# Altium project FlightLogger.PrjPcb
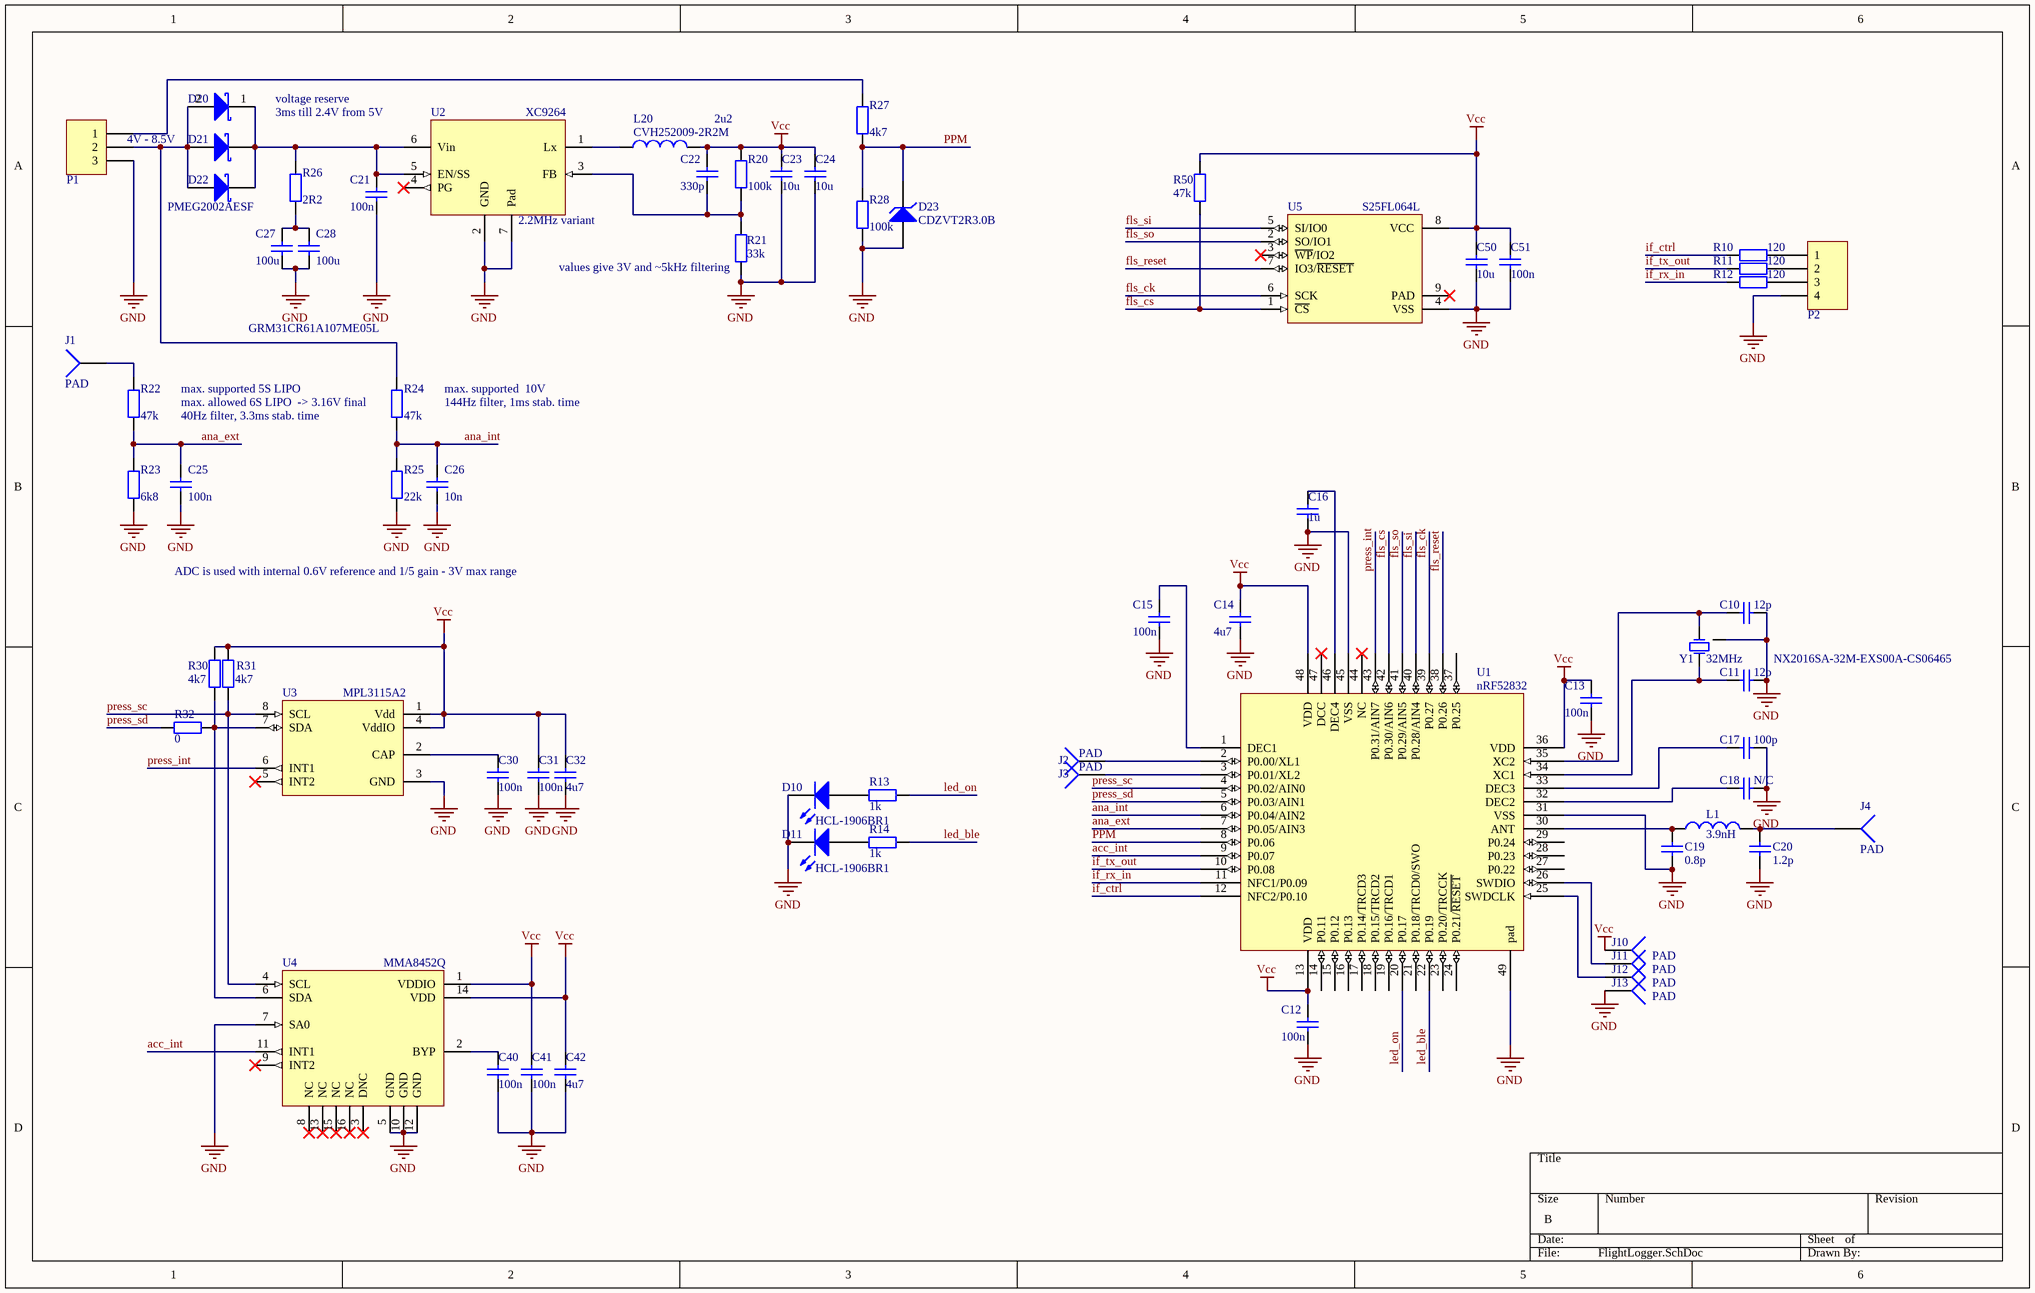
[diagram p0: FlightLogger.SchDoc]
1 sheet, 69 parts. Net scope: global (net labels, ports and power ports of the same name join across sheets).
Board file: FlightLogger.PcbDoc

## Sheet FlightLogger.SchDoc
size B; PageSetup: Record=PageOptions|CenterHorizontal=True|CenterVertical=True|PrintScale=0.70|XCorrection=1.00|YCorrection=1.00|PrintKind=1|BorderSize=5000000|LeftOffset=0|BottomOffset=0|Orientation=2|PaperLength=1000|PaperWidth=1000|Scale=100|PaperSource=7|PrintQuality=-4|MediaType=1|DitherType=10|PrintScaleMode=1|PaperKind=Letter 8.5"x11" 22x28cm|PaperIndex=1

### Parts
C10  12p  [0402_cap]
C11  12p  [0402_cap]
C12  100n  [0402_cap]
C13  100n  [0402_cap]
C14  4u7  [0402_cap]
C15  100n  [0402_cap]
C16  1u  [0402_cap]
C17  100p  [0402_cap]
C18  N/C  [0402_cap]
C19  0.8p  [0402_cap]
C20  1.2p  [0402_cap]
C21  100n  [0402_cap]
C22  330p  [0402_cap]
C23  10u  [0402_cap]
C24  10u  [0402_cap]
C25  100n  [0402_cap]
C26  10n  [0402_cap]
C27  PartNo: GRM31CR61A107ME05L  [1206_cap]  (hidden comment: 100u)
C28  100u  [1206_cap]
C30  100n  [0402_cap]
C31  100n  [0402_cap]
C32  4u7  [0402_cap]
C40  100n  [0402_cap]
C41  100n  [0402_cap]
C42  4u7  [0402_cap]
C50  10u  [0402_cap]
C51  100n  [0402_cap]
D10  HCL-1906BR1  [0603_led_green]
D11  HCL-1906BR1  [0603_led_green]
D20  PMEG2002AESF  [SOD962_2]  (value not drawn)
D21  PMEG2002AESF  [SOD962_2]  (value not drawn)
D22  PMEG2002AESF  [SOD962_2]
D23  CDZVT2R3.0B  [VMN2M]
J1  PAD  [PAD_0.6x1mm]
J2  PAD  [PAD_0.6x1mm]
J3  PAD  [PAD_0.6x1mm]
J4  PAD  [PAD_0.6x1mm]
J10  PAD  [PAD_0.6x1mm]
J11  PAD  [PAD_0.6x1mm]
J12  PAD  [PAD_0.6x1mm]
J13  PAD  [PAD_0.6x1mm]
L1  3.9nH  [0402_res]
L20  CVH252009-2R2M  value 2u2  [1008_Inductor]
P1  Conn3  [HDR1X3]  (value not drawn)
P2  Conn4  [conn_4pin_1row_1mm]  (value not drawn)
R10  120  [0402_res]
R11  120  [0402_res]
R12  120  [0402_res]
R13  1k  [0402_res]
R14  1k  [0402_res]
R20  100k  [0402_res]
R21  33k  [0402_res]
R22  47k  [0402_res]
R23  6k8  [0402_res]
R24  47k  [0402_res]
R25  22k  [0402_res]
R26  2R2  [0603_res]
R27  4k7  [0402_res]
R28  100k  [0402_res]
R30  4k7  [0402_res]
R31  4k7  [0402_res]
R32  0  [0402_res]
R50  47k  [0402_res]
U1  nRF52832  [QFN48]
U2  XC9264  [USP-6C]
U3  MPL3115A2  [MPL3115A2]
U4  MMA8452Q  [QFN16SP]
U5  S25FL064L  [USON8]
Y1  32MHz  Part.No: NX2016SA-32M-EXS00A-CS06465  [Cristal_2_1.6_4pin]

### Nets
GND: C10.1 C11.1 C12.2 C13.2 C14.2 C15.2 C16.2 C17.1 C18.1 C19.1 C20.1 C21.2 C23.2 C24.2 C25.2 C26.2 C27.1 C28.1 C30.1 C31.1 C32.1 C40.1 C41.1 C42.1 C50.1 C51.1 D10.2(K) D11.2(K) D23.1(A) J13.1 P1.3 P2.4 R21.1 R23.2 R25.2 R28.2 U1.31(VSS) U1.45(VSS) U1.49(pad) U2.2(GND) U2.7(Pad) U3.3(GND) U4.5(GND) U4.7(SA0) U4.10(GND) U4.12(GND) U5.4(VSS) Y1.2(GND)
Vcc: C12.1 C13.1 C14.1 C22.1 C23.1 C24.1 C31.2 C32.2 C41.2 C42.2 C50.2 C51.2 J10.1 L20.2 R20.1 R30.1 R31.1 R50.1 U1.13(VDD) U1.36(VDD) U1.48(VDD) U3.1(Vdd) U3.4(VddIO) U4.1(VDDIO) U4.14(VDD) U5.8(VCC)
acc_int: U1.9(P0.07) U4.11(INT1)
ana_ext: C25.1 R22.2 R23.1 U1.7(P0.05/AIN3)
ana_int: C26.1 R24.2 R25.1 U1.6(P0.04/AIN2)
fls_ck: U1.39(P0.27) U5.6(SCK)
fls_cs: R50.2 U1.42(P0.30/AIN6) U5.1(~{CS})
fls_reset: U1.38(P0.26) U5.7(IO3/~{RESET})
fls_si: U1.40(P0.28/AIN4) U5.5(SI/IO0)
fls_so: U1.41(P0.29/AIN5) U5.2(SO/IO1)
if_ctrl: R10.2 U1.12(NFC2/P0.10)
if_rx_in: R12.2 U1.11(NFC1/P0.09)
if_tx_out: R11.2 U1.10(P0.08)
led_ble: R14.1 U1.22(P0.19)
led_on: R13.1 U1.20(P0.17)
PPM: D23.2(K) R27.2 R28.1 U1.8(P0.06)
press_int: U1.43(P0.31/AIN7) U3.6(INT1)
press_sc: R31.2 U1.4(P0.02/AIN0) U3.8(SCL) U4.4(SCL)
press_sd: R32.2 U1.5(P0.03/AIN1)
NetC10_2: C10.2 U1.35(XC2) Y1.1(OSC1)
NetC11_2: C11.2 U1.34(XC1) Y1.3(OSC2)
NetC15_1: C15.1 U1.1(DEC1)
NetC16_1: C16.1 U1.46(DEC4)
NetC17_2: C17.2 U1.33(DEC3)
NetC18_2: C18.2 U1.32(DEC2)
NetC19_2: C19.2 L1.1 U1.30(ANT)
NetC20_2: C20.2 J4.1 L1.2
NetC21_1: C21.1 D20.1(K) D21.1(K) D22.1(K) R26.1 U2.5(EN/SS) U2.6(Vin)
NetC22_2: C22.2 R20.2 R21.2 U2.3(FB)
NetC27_2: C27.2 C28.2 R26.2
NetC30_2: C30.2 U3.2(CAP)
NetC40_2: C40.2 U4.2(BYP)
NetD10_1: D10.1(A) R13.2
NetD11_1: D11.1(A) R14.2
NetD20_2: D20.2(A) D21.2(A) D22.2(A) P1.2 R24.1
NetJ1_1: J1.1 R22.1
NetJ2_1: J2.1 U1.2(P0.00/XL1)
NetJ3_1: J3.1 U1.3(P0.01/XL2)
NetJ11_1: J11.1 U1.26(SWDIO)
NetJ12_1: J12.1 U1.25(SWDCLK)
NetL20_1: L20.1 U2.1(Lx)
NetP1_1: P1.1 R27.1
NetP2_1: P2.1 R10.1
NetP2_2: P2.2 R11.1
NetP2_3: P2.3 R12.1
NetR30_2: R30.2 R32.1 U3.7(SDA) U4.6(SDA)

Not connected (* = marked no-connect by the designer): U1 14(P0.11) 15(P0.12) 16(P0.13) 17(P0.14/TRCD3) 18(P0.15/TRCD2) 19(P0.16/TRCD1) 21(P0.18/TRCD0/SWO) 23(P0.20/TRCCK) 24(P0.21/~{RESET}) 27(P0.22) 28(P0.23) 29(P0.24) 37(P0.25) 44(NC)* 47(DCC)*; U2 4(PG)*; U3 5(INT2)*; U4 3(DNC)* 8(NC)* 9(INT2)* 13(NC)* 15(NC)* 16(NC)*; U5 3(~{WP}/IO2)* 9(PAD)*

### Notes on the sheet
- voltage reserve
- 4V - 8.5V
- 3ms till 2.4V from 5V
- (near U2) 2.2MHz variant
- (near R21) values give 3V and ~5kHz filtering
- (near R22) max. supported 5S LIPO
- (near R24) max. allowed 6S LIPO  -> 3.16V final
- 40Hz filter, 3.3ms stab. time
- (near R24) max. supported  10V
- 144Hz filter, 1ms stab. time
- ADC is used with internal 0.6V reference and 1/5 gain - 3V max range

### Library data of the parts
C10-C27 C30-C32 C40-C42 C50 C51 = CAP: Capacitor; Published: 8-Jun-2000; LatestRevisionDate: 17-Jul-2002; LatestRevisionNote: Re-released for DXP Platform.; PackageReference: RAD-0.3; Publisher: Altium Limited; PackageDescription: Radial Cap, Thru-Hole; 2 Leads; 0.3 in Pin Spacing
  C10 C11: Value: 12p
  C12 C13 C15 C21 C25 C30 C31 C40 C41 C51: Value: 100n
  C14 C32 C42: Value: 4u7
  C16: Value: 1u
  C17: Value: 100p
  C18: Value: N/C
  C19: Value: 0.8p
  C20: Value: 1.2p
  C22: Value: 330p
  C23 C24 C50: Value: 10u
  C26: Value: 10n
  C27: Value: 100u
C28 = CAP: Capacitor; PartNo: GRM31CR61A107ME05L; Published: 8-Jun-2000; LatestRevisionDate: 17-Jul-2002; LatestRevisionNote: Re-released for DXP Platform.; PackageReference: RAD-0.3; Publisher: Altium Limited; PackageDescription: Radial Cap, Thru-Hole; 2 Leads; 0.3 in Pin Spacing; Value: 100u
D10 D11 = LED: Typical RED, GREEN, YELLOW, AMBER GaAs LED; Published: 8-Jun-2000; LatestRevisionDate: 17-Jul-2002; LatestRevisionNote: Re-released for DXP Platform.; PackageVersion: Feb-2002; PackageReference: 3.2X1.6X1.1; Publisher: Altium Limited; PackageDescription: SM LED; 2 Flat Leads
D20-D22 = 1PS76SB10: Schottky Barrier Diode; Published: 17-Sep-2003; LatestRevisionDate: 19-Mar-2004; LatestRevisionNote: Silkscreen size reduced.; DatasheetVersion: 14-Oct-1996; PackageVersion: May-1999; PackageReference: SOD323; Publisher: Altium Limited; PackageDescription: SOD-323/SC-76; 2 Leads; Body 1.7 x 1.3 mm, (LxW); ComponentLink1Description: Manufacturer Link; ComponentLink1URL: http://www.semiconductors.philips.com/; ComponentLink2Description: Datasheet; ComponentLink2URL: http://www.semiconductors.philips.com/acrobat/datasheets/1PS76SB10_2.pdf
D23 = D Zener: Zener Diode; Published: 8-Jun-2000; LatestRevisionDate: 17-Jul-2002; LatestRevisionNote: Re-released for DXP Platform.; PackageReference: DIODE-0.7; Publisher: Altium Limited; PackageDescription: Diode, Thru-Hole; 2 Leads; 0.7 in Pin Spacing
L1 L20 = Inductor: Code_IEC: 1005; Published: 8-Jun-2000; LatestRevisionDate: 29-May-2009; LatestRevisionNote: IPC-7351 Footprint Added.; PackageReference: 0402-A; Publisher: Altium Limited; PackageDescription: Chip Inductor; Code_JEITA: 0402
  L1: Value: 3.9nH
P1 = conn_3pin_1: 3pin connection; LatestRevisionDate: 17-Jul-2002; LatestRevisionNote: Re-released for DXP Platform.; Publisher: Altium Limited
P2 = conn_4pin: 4pin connection; LatestRevisionDate: 17-Jul-2002; LatestRevisionNote: Re-released for DXP Platform.; Publisher: Altium Limited
R10-R14 R20-R28 R30-R32 R50 = RES: Resistor; Published: 8-Jun-2000; LatestRevisionDate: 17-Jul-2002; LatestRevisionNote: Re-released for DXP Platform.; PackageReference: AXIAL-0.4; Publisher: Altium Limited; PackageDescription: Axial Device, Thru-Hole; 2 Leads; 0.4 in Pin Spacing
  R10-R12: Value: 120
  R13 R14: Value: 1k
  R20 R28: Value: 100k
  R21: Value: 33k
  R22 R24 R50: Value: 47k
  R23: Value: 6k8
  R25: Value: 22k
  R26: Value: 2R2
  R27 R30 R31: Value: 4k7
  R32: Value: 0
U1 = nRF52832: ARM Cortex M4  microcontroller with 2.4GHz radio
U2 = XC9264: 18V 0.5A step down DC-DC converter; Part nr.: AD8418AWBRMZ-RL
U3 = MPL3115A2: Precision barometer sensor I2C; Published: 14-Mar-2008; DatasheetVersion: Aug-2006; PackageVersion: Mar-2006; PackageReference: MLF22D-08; Publisher: Altium Limited; PackageDescription: MLF (2mm x 2mm) Ultra-Small, 8 Leads; ComponentLink1Description: Manufacturer Link; ComponentLink1URL: http://www.micrel.com/; ComponentLink2Description: Datasheet; ComponentLink2URL: http://www.micrel.com/_PDF/mic94066-69.pdf
U4 = MMA8452Q: 3 axis accelerometer; Published: 14-Mar-2008; DatasheetVersion: Aug-2006; PackageVersion: Mar-2006; PackageReference: MLF22D-08; Publisher: Altium Limited; PackageDescription: MLF (2mm x 2mm) Ultra-Small, 8 Leads; ComponentLink1Description: Manufacturer Link; ComponentLink1URL: http://www.micrel.com/; ComponentLink2Description: Datasheet; ComponentLink2URL: http://www.micrel.com/_PDF/mic94066-69.pdf
U5 = S25FL064L: 64Mbit NOR flash; Published: 14-Mar-2008; DatasheetVersion: Aug-2006; PackageVersion: Mar-2006; PackageReference: MLF22D-08; Publisher: Altium Limited; PackageDescription: MLF (2mm x 2mm) Ultra-Small, 8 Leads; ComponentLink1Description: Manufacturer Link; ComponentLink1URL: http://www.micrel.com/; ComponentLink2Description: Datasheet; ComponentLink2URL: http://www.micrel.com/_PDF/mic94066-69.pdf
Y1 = XTAL: Crystal Oscillator; Published: 8-Jun-2000; LatestRevisionDate: 17-Jul-2002; LatestRevisionNote: Re-released for DXP Platform.; PackageReference: R38; Publisher: Altium Limited; PackageDescription: Crystal, Thru-Hole; 2 Leads; Body 3.1 x 8.2 mm (Dia.xH)
J1-J4 J10-J13 = PAD: LatestRevisionDate: 17-Jul-2002; LatestRevisionNote: Re-released for DXP Platform.; Publisher: Altium Limited